# Altium schematic sheet LAUNCHXL-F28069_B_1400922_4.SchDoc: LAUNCHXL-F28069_B_1400922
size 301 x 234 mm; Origin: Eagle; Date: 2023/6/4 16:46:29; SheetNumber: 5; GateName_1: G$1; SymbolName_1: FRAME_A_L; LibraryName: frames; DeviceSetName: FRAME_A_L; GateName_2: G$2; SymbolName_2: DOCFIELD; Sheet: Sheet:; REV: REV:; COMPANY: COMPANY:; Scale:1/1: Scale: 1/1; Drawn: Drawn; Checked: Checked; Approved: Approved; Embest: Embest
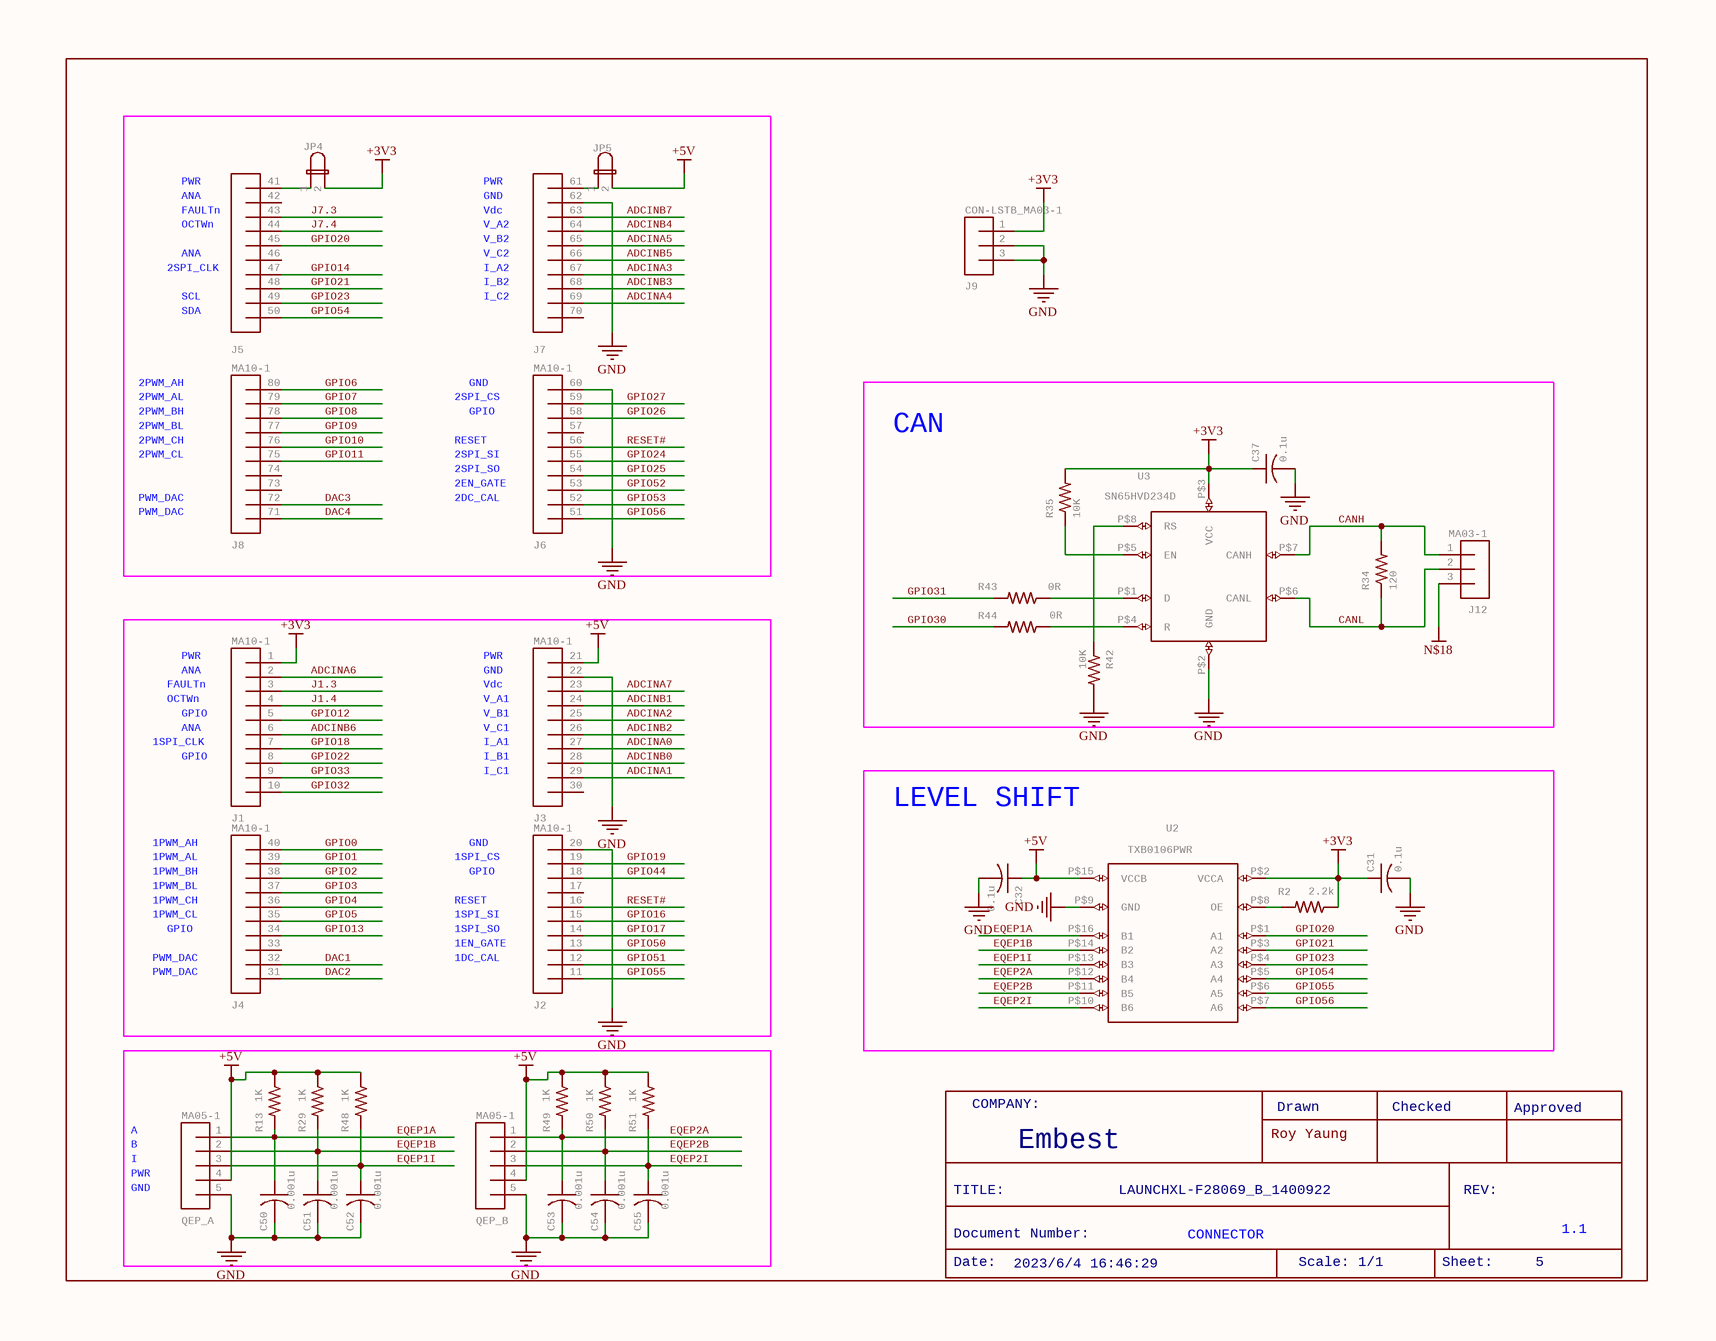
[diagram p0: LAUNCHXL-F28069_B_1400922_4.SchDoc]

## Parts
C31  0.1u  [C0402]
C32  0.1u  [C0402]
C37  0.1u  [C0402]
C50  0.001u  [C0402]
C51  0.001u  [C0402]
C52  0.001u  [C0402]
C53  0.001u  [C0402]
C54  0.001u  [C0402]
C55  0.001u  [C0402]
J1  MA10-1  [MA10-1]
J2  MA10-1  [MA10-1]
J3  MA10-1  [MA10-1]
J4  MA10-1  [MA10-1]
J5  MA10-1  [MA10-1]  (value not drawn)
J6  MA10-1  [MA10-1]
J7  MA10-1  [MA10-1]  (value not drawn)
J8  MA10-1  [MA10-1]
J9  CON-LSTB_MA03-1  [CON-LSTB_MA03-1]
J12  MA03-1  [MA03-1]
JP4  JP1ENORM  [JP1]  (value not drawn)
JP5  JP1ENORM  [JP1]  (value not drawn)
QEP_A  MA05-1  [MA05-1]
QEP_B  MA05-1  [MA05-1]
R2  2.2k  [R0402]
R13  1K  [R0402]
R29  1K  [R0402]
R34  120  [R0402]
R35  10K  [R0402]
R42  10K  [R0402]
R43  0R  [R0402]
R44  0R  [R0402]
R48  1K  [R0402]
R49  1K  [R0402]
R50  1K  [R0402]
R51  1K  [R0402]
U2  TXB0106PWR  [TSSOP16-PW]
U3  SN65HVD234D  [SOIC8-PDSO]
U$12  ROY_JUMPER  [ROY_JUMPER]  (value not drawn)
U$13  ROY_JUMPER  [ROY_JUMPER]  (value not drawn)

## Blocks framed on the sheet
CAN: C37 J12 R34 R35 R42-R44 U3
LEVEL SHIFT: C31 C32 R2 U2

## Nets
+3V3: C31.1 C37.1 J1.1 J9.1 JP4.2 R2.1 R35.2 U2.P$2(VCCA) U3.P$3(VCC)
EQEP1A: C32.1 C50.1 C51.1 C52.1 C53.1 C54.1 C55.1 J3.1 JP5.2 QEP_A.1 QEP_A.2 QEP_A.3 QEP_A.4 QEP_B.1 QEP_B.2 QEP_B.3 QEP_B.4 R13.1 R13.2 R29.1 R29.2 R48.1 R48.2 R49.1 R49.2 R50.1 R50.2 R51.1 R51.2 U2.P$10(B6) U2.P$11(B5) U2.P$12(B4) U2.P$13(B3) U2.P$14(B2) U2.P$15(VCCB) U2.P$16(B1)  [also labelled +5V, EQEP1B, EQEP1I, EQEP2A, EQEP2B, EQEP2I]
GND: C31.2 C32.2 C37.2 C50.2 C51.2 C52.2 C53.2 C54.2 C55.2 J2.1 J3.2 J6.1 J7.2 J9.2 J9.3 QEP_A.5 QEP_B.5 R42.2 U2.P$9(GND) U3.P$2(GND)
N$18: J12.3
ADCINA0: J3.7
ADCINA1: J3.9
ADCINA2: J3.5
ADCINA3: J7.7
ADCINA4: J7.9
ADCINA5: J7.5
ADCINA6: J1.2
ADCINA7: J3.3
ADCINB0: J3.8
ADCINB1: J3.4
ADCINB2: J3.6
ADCINB3: J7.8
ADCINB4: J7.4
ADCINB5: J7.6
ADCINB6: J1.6
ADCINB7: J7.3
CANH: J12.1 R34.2 U3.P$7(CANH)
CANL: J12.2 R34.1 U3.P$6(CANL)
DAC1: J4.9
DAC2: J4.10
DAC3: J8.9
DAC4: J8.10
GPIO0: J4.1
GPIO1: J4.2
GPIO2: J4.3
GPIO3: J4.4
GPIO4: J4.5
GPIO5: J4.6
GPIO6: J8.1
GPIO7: J8.2
GPIO8: J8.3
GPIO9: J8.4
GPIO10: J8.5
GPIO11: J8.6
GPIO12: J1.5
GPIO13: J4.7
GPIO14: J5.7
GPIO16: J2.6
GPIO17: J2.7
GPIO18: J1.7
GPIO19: J2.2
GPIO20: J5.5 U2.P$1(A1)
GPIO21: J5.8 U2.P$3(A2)
GPIO22: J1.8
GPIO23: J5.9 U2.P$4(A3)
GPIO24: J6.6
GPIO25: J6.7
GPIO26: J6.3
GPIO27: J6.2
GPIO30: R44.2
GPIO31: R43.2
GPIO32: J1.10
GPIO33: J1.9
GPIO44: J2.3
GPIO50: J2.8
GPIO51: J2.9
GPIO52: J6.8
GPIO53: J6.9
GPIO54: J5.10 U2.P$5(A4)
GPIO55: J2.10 U2.P$6(A5)
GPIO56: J6.10 U2.P$7(A6)
J1.3: J1.3
J1.4: J1.4
J7.3: J5.3
J7.4: J5.4
RESET#: J2.5 J6.5
NetJ5_1: J5.1 JP4.1
NetJ7_1: J7.1 JP5.1
NetR2_2: R2.2 U2.P$8(OE)
NetR35_1: R35.1 U3.P$5(EN)
NetR42_1: R42.1 U3.P$8(RS)
NetR43_1: R43.1 U3.P$1(D)
NetR44_1: R44.1 U3.P$4(R)

Not connected (* = marked no-connect by the designer): J2 4; J3 10; J4 8; J5 2 6; J6 4; J7 10; J8 7 8

## Notes on the sheet
- (near J5) PWR
- (near J5) ANA
- (near J5) FAULTn
- (near J5) 41
- (near J5) 42
- (near J5) 43
- (near J7) PWR
- (near J7) GND
- (near J7) Vdc
- 61
- 62
- (near J7) 63
- (near J5) 2SPI_CLK
- (near J5) OCTWn
- (near J5) 44
- (near J5) 45
- (near J5) 46
- (near J5) 47
- (near J5) 48
- (near J7) V_A2
- (near J7) V_B2
- (near J7) V_C2
- (near J7) I_A2
- (near J7) I_B2
- (near J7) 64
- (near J7) 65
- (near J7) 66
- (near J7) 67
- (near J7) 68
- (near J5) SCL
- (near J5) SDA
- (near J5) 49
- (near J5) 50
- (near J7) I_C2
- (near J7) 69
- (near J7) 70
- 2PWM_AH
- 2PWM_AL
- 2PWM_BH
- 2PWM_BL
- (near J8) 77
- (near J8) 78
- (near J8) 79
- (near J8) 80
- 2SPI_CS
- GND
- GPIO
- (near J6) 57
- (near J6) 58
- (near J6) 59
- (near J6) 60
- 2PWM_CH
- 2PWM_CL
- PWM_DAC
- (near J8) 72
- (near J8) 73
- (near J8) 74
- (near J8) 75
- (near J8) 76
- RESET
- 2SPI_SI
- 2SPI_SO
- 2EN_GATE
- 2DC_CAL
- (near J6) 52
- (near J6) 53
- (near J6) 54
- (near J6) 55
- (near J6) 56
- (near J8) 71
- (near J6) 51
- (near J1) FAULTn
- OCTWn
- (near J1) PWR
- (near J1) ANA
- (near J1) GPIO
- (near J1) 1
- (near J1) 2
- (near J1) 3
- (near J1) 4
- (near J1) 5
- (near J3) Vdc
- (near J3) V_A1
- (near J3) V_B1
- (near J3) PWR
- (near J3) GND
- (near J3) 21
- (near J3) 22
- (near J3) 23
- (near J3) 24
- (near J3) 25
- 1SPI_CLK
- (near J1) 6
- (near J1) 7
- (near J1) 8
- (near J1) 9
- (near J1) 10
- (near J3) V_C1
- (near J3) I_A1
- (near J3) I_B1
- (near J3) I_C1
- (near J3) 26
- (near J3) 27
- (near J3) 28
- (near J3) 29
- (near J3) 30
- 1PWM_AH
- 1PWM_AL
- (near J4) 39
- (near J4) 40
- 1SPI_CS
- (near J2) 19
- (near J2) 20
- 1PWM_BH
- 1PWM_BL
- 1PWM_CH
- 1PWM_CL
- (near J4) 34
- (near J4) 35
- (near J4) 36
- (near J4) 37
- (near J4) 38
- 1SPI_SI
- 1SPI_SO
- (near J2) 14
- (near J2) 15
- (near J2) 16
- (near J2) 17
- (near J2) 18
- (near J4) 31
- (near J4) 32
- (near J4) 33
- 1EN_GATE
- 1DC_CAL
- (near J2) 11
- (near J2) 12
- (near J2) 13
- A
- B
- COMPANY:
- Roy Yaung
- Drawn
- Checked
- Approved
- I
- (near QEP_A) GND
- (near QEP_A) PWR
- TITLE:
- Embest
- LAUNCHXL-F28069_B_1400922
- REV:
- Date:
- Document Number:
- 2023/6/4 16:46:29
- CONNECTOR
- Scale: 1/1
- Sheet:
- 5
- 1.1

## Library data of the parts
C31 C32 C37 C50-C55 = C-USC0402: CAPACITOR, American symbol; GateName_1: G$1; SymbolName_1: C-US; DeviceName: C0402; LibraryName: rcl; DeviceSetName: C-US
J1-J8 = MA10-1: PIN HEADER; GateName_1: 1; SymbolName_1: MA10-1; LibraryName: con-lstb; DeviceSetName: MA10-1; MF: MF; MPN: MPN; OC_FARNELL: unknown; OC_NEWARK: unknown
J9 = CON-LSTB_MA03-1: PIN HEADER; GateName_1: G$1; SymbolName_1: CON-LSTB_MA03-1; LibraryName: LAUNCHXL-F28027; DeviceSetName: CON-LSTB_MA03-1; MF: MF; MPN: MPN; OC_FARNELL: unknown; OC_NEWARK: unknown
J12 = MA03-1: PIN HEADER; GateName_1: G$1; SymbolName_1: MA03-1; LibraryName: con-lstb; DeviceSetName: MA03-1; MF: MF; MPN: MPN; OC_FARNELL: unknown; OC_NEWARK: unknown
JP4 JP5 = JP1ENORM: JUMPER; GateName_1: A; SymbolName_1: JP2E; DeviceName: NORM; DeviceSetName: JP1E; LibraryName: jumper
QEP_A QEP_B = MA05-1: PIN HEADER; GateName_1: G$1; SymbolName_1: MA05-1; LibraryName: con-lstb; DeviceSetName: MA05-1; MF: MF; MPN: MPN; OC_FARNELL: unknown; OC_NEWARK: unknown
R2 R13 R29 R34 R35 R42-R44 R48-R51 = R-US_R0402: RESISTOR, American symbol; GateName_1: G$1; SymbolName_1: R-US; DeviceSetName: R-US_; DeviceName: R0402; LibraryName: rcl
U2 = TXB0106PWR: GateName_1: G$1; SymbolName_1: TXB0106; LibraryName: LAUNCHXL-F28027; DeviceSetName: TXB0106PWR
U3 = SN65HVD234D: GateName_1: G$1; SymbolName_1: SN65HVD234; LibraryName: LAUNCHXL-F28027; DeviceSetName: SN65HVD234D
U$12 U$13 = ROY_JUMPER: GateName_1: G$1; SymbolName_1: ROY_JUMPER; LibraryName: roy; DeviceSetName: ROY_JUMPER